# EAGLE design MorsePendant (EAGLE 7.6.0)

## Sheet 1 of 2
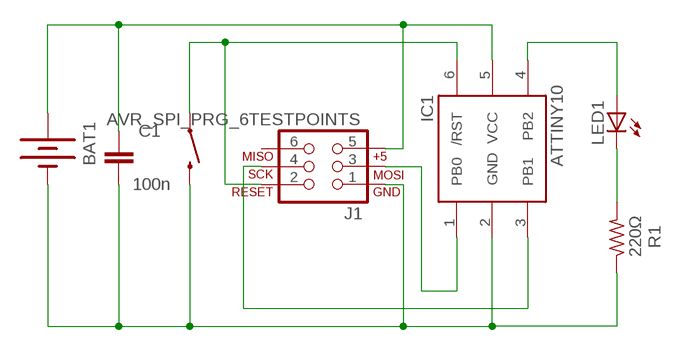
[diagram p0: schematic, sheet 1]

### Parts
BAT1  BATTERY12MM  [BATTCON_12MM]
C1  100n  CAP0603-CAP  [0603-CAP]
IC1  ATTINY10  [SOT23-6]
J1  AVR_SPI_PRG_6TESTPOINTS  [2X3_TEST_POINTS]
LED1  LEDCHIPLED_0805  [CHIPLED_0805]
R1  220Ω  R-US_R0805  [R0805]
S2  SWITCH-MOMENTARY-2SMD  [TACTILE-SWITCH-SMD]

### Nets
N$1: BAT1.PWR@1(+) C1.1 IC1.5(VCC) J1.5
N$2: IC1.6(/RST) J1.2 S2.1
N$4: IC1.4(PB2) LED1.A
N$5: LED1.C R1.2
N$6: IC1.1(PB0) J1.3
N$7: BAT1.GND(-) C1.2 IC1.2(GND) J1.1 R1.1 S2.3
N$8: IC1.3(PB1) J1.4
Unconnected: J1.6

## Sheet 2 of 2

## Library data of the parts
BAT1 = SparkFun-Electromechanical:BATTERY: Battery Holders Various common sizes : AA, AAA, 18650 (PRT-12895), 20mm coin cell and 12mm coin cell. 20MM_4LEGS, BATT-10373; PROD_ID: BATT-08044
C1 = SparkFun-Capacitors:CAP: Capacitor Standard 0603 ceramic capacitor, and 0.1" leaded capacitor.
IC1 = adafruit:ATTINY10: ATtiny4/5/9/10 8-bit Microcontroller with 512/1024 Bytes In-System Programmable Flash
J1 = technoblogy:AVR_SPI_PRG_6: AVR ISP 6 Pin This is the reduced ISP connector for AVR programming. Common on Arduino. This footprint will take up less PCB space and can be used with a 10-pin to 6-pin adapter such as SKU: BOB-08508 **Special note about "TEST_POINT" package. The stop mask is on the top side, so if you want your programming test points to be on the bottom of your board, make sure to place this package on the bottom side of the board. This also ensure that the orientation to program from the bottom side will be correct.
LED1 = adafruit:LED: LED OSRAM: - CHIPLED LG R971, LG N971, LY N971, LG Q971, LY Q971, LO R971, LY R971 LH N974, LH R974 LS Q976, LO Q976, LY Q976 LO Q996 - Hyper CHIPLED LW Q18S LB Q993, LB Q99A, LB R99A - SideLED LS A670, LO A670, LY A670, LG A670, LP A670 LB A673, LV A673, LT A673, LW A673 LH A674 LY A675 LS A676, LA A676, LO A676, LY A676, LW A676 LS A679, LY A679, LG A679 - Hyper Micro SIDELED® LS Y876, LA Y876, LO Y876, LY Y876 LT Y87S - SmartLED LW L88C, LW L88S LB L89C, LB L89S, LG L890 LS L89K, LO L89K, LY L89K LS L896, LA L896, LO L896, LY L896 - TOPLED LS T670, LO T670, LY T670, LG T670, LP T670 LSG T670, LSP T670, LSY T670, LOP T670, LYG T670 LG T671, LOG T671, LSG T671 LB T673, LV T673, LT T673, LW T673 LH T674 LS T676, LA T676, LO T676, LY T676, LB T676, LH T676, LSB T676, LW T676 LB T67C, LV T67C, LT T67C, LS T67K, LO T67K, LY T67K, LW E67C LS E67B, LA E67B, LO E67B, LY E67B, LB E67C, LV E67C, LT E67C LW T67C LS T679, LY T679, LG T679 LS T770, LO T770, LY T770, LG T770, LP T770 LB T773, LV T773, LT T773, LW T773 LH T774 LS E675, LA E675, LY E675, LS T675 LS T776, LA T776, LO T776, LY T776, LB T776 LHGB T686 LT T68C, LB T68C - Hyper Mini TOPLED® LB M676 - Mini TOPLED Santana® LG M470 LS M47K, LO M47K, LY M47K Source: http://www.osram.convergy.de/
R1 = adafruit:R-US_: RESISTOR, American symbol
S2 = SparkFun-Electromechanical:SWITCH-MOMENTARY-2: Various NO switches- pushbuttons, reed, etc; PROD_ID: SWCH-08247

## Board
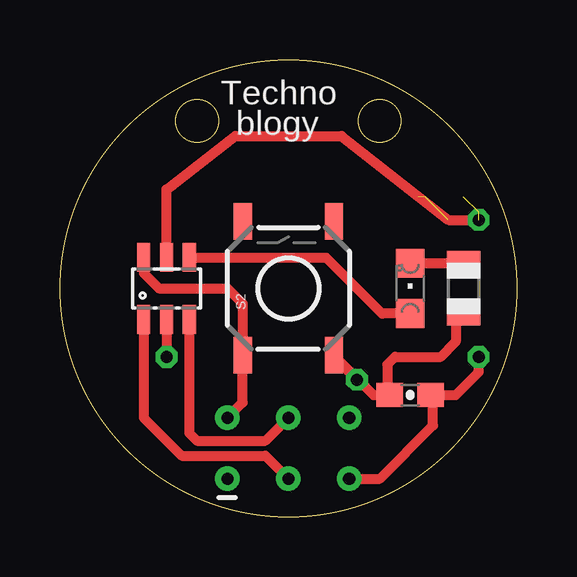
[diagram p1: board, top side]
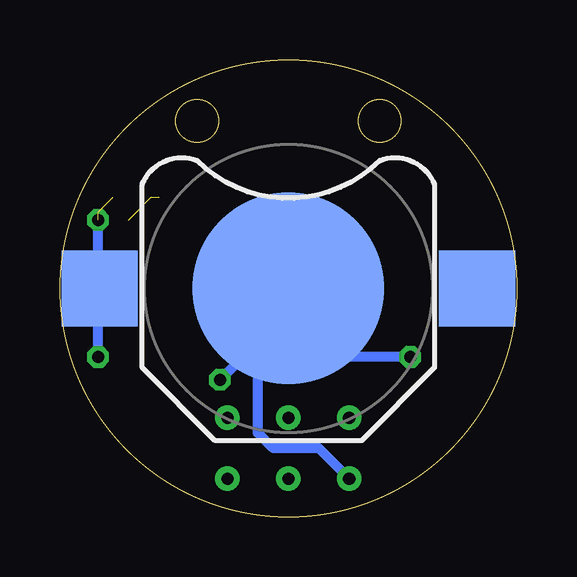
[diagram p2: board, bottom side, seen from below]

Size 19.05 x 19.05 mm. Coordinates in mm from the lower left corner, seen from the top.
Outline: circle at 9.53,9.53 radius 9.53
Outline: circle at 5.71,16.51 radius 0.9
Outline: circle at 13.34,16.51 radius 0.9
Copper layers (1*16): Top 0.035mm / dielectric 1.5mm / Bottom 0.035mm
Design rules "default *": minimum track width 10mil, minimum drill 24mil, track to track 8mil, track to pad 8mil, pad to pad 8mil, via to via 8mil, smd to smd 8mil, copper to edge 40mil, drill to drill 8mil, minimum pad ring 10mil, minimum via ring 8mil, stop-mask expansion 4mil, vias tented up to drill 20mil, thermal gap 10mil

### Footprints (pad centres in the part's own frame; a part is rotated, then mirrored left to right if it is on the bottom)
BATTCON_12MM = smd 8 x 8: GND 0,0 | smd 3.175 x 3.175: PWR@1 -7.874,0; PWR@2 7.874,0
0603-CAP = smd 1.1 x 1: 1 -0.85,0; 2 0.85,0
SOT23-6 = smd 0.55 x 1.2: 1 -0.95,-1.3; 2 0,-1.3; 3 0.95,-1.3; 4 0.95,1.3; 5 0,1.3; 6 -0.95,1.3
2X3_TEST_POINTS = drill 0.508: 1 -2.54,-1.27; 2 -2.54,1.27; 3 0,-1.27; 4 0,1.27; 5 2.54,-1.27; 6 2.54,1.27
CHIPLED_0805 = smd 1.2 x 1.2: A 0,-1.05; C 0,1.05
R0805 = smd 1.1 x 1.4: 1 -1,0; 2 1,0
TACTILE-SWITCH-SMD = smd 1.524 x 0.762: 1 -2.794,1.905; 2 2.794,1.905; 3 -2.794,-1.905; 4 2.794,-1.905

### Placement (x,y rotation side)
BAT1  9.53,9.53 0 bottom
C1  14.61,5.08 180 top
IC1  4.45,9.53 0 top
J1  9.53,2.86 0 top
LED1  14.61,9.53 0 top
R1  16.83,9.53 90 top
S2  9.53,9.53 90 top

### Tracks (layer width: path | path; a pad name or v marks a point on that pad's centre or on a via)
N$1  (via drill 0.5)  (4 unrouted)
  Top 0.406: J1.5 13.34,1.59 15.56,3.81 15.56,4.98 C1.1 16.51,5.08 17.46,6.03 v17.46,6.67 | IC1.5 4.45,13.65 7.3,15.88 11.75,15.88 16.19,12.38 v17.46,12.38
  Bottom 0.406: v17.46,6.67 17.46,9.46 BAT1.PWR@1 17.46,9.53 v17.46,12.38
N$2
  Top 0.406: IC1.6 3.5,10.16 4.13,9.53 6.99,9.53 7.62,8.89 S2.1 7.62,4.76 J1.2
N$4
  Top 0.406: LED1.A 13.43,8.47 11.11,10.79 5.42,10.79 IC1.4
N$5
  Top 0.406: LED1.C 16.83,10.57 R1.2
N$6
  Top 0.406: IC1.1 3.5,4.12 5.08,2.54 8.57,2.54 J1.3
N$7  (via drill 0.5)
  Top 0.406: v12.38,5.71 11.43,6.67 S2.3 13.08,5.08 C1.2 13.65,5.18 13.65,6.35 13.97,6.67 15.88,6.67 16.51,7.3 16.51,8.53 R1.1 | IC1.2 v4.45,6.67
  Bottom 0.406: 10.16,7.94 9.68,8.41 | 9.68,8.41 9.53,8.57 BAT1.GND | J1.1 8.26,2.86 10.16,2.86 10.79,3.49 10.79,6.99 10.95,7.14 | v12.38,5.71 10.95,7.14 | 10.95,7.14 10.16,7.94 | 10.16,7.94 10.16,8.89 11.43,7.62 S2.3 | v4.45,6.67 7.94,6.67 9.68,8.41
N$8
  Top 0.406: IC1.3 5.39,3.5 5.71,3.17 8.57,3.17 J1.4

### Text on the board
tPlace: Techno | blogy